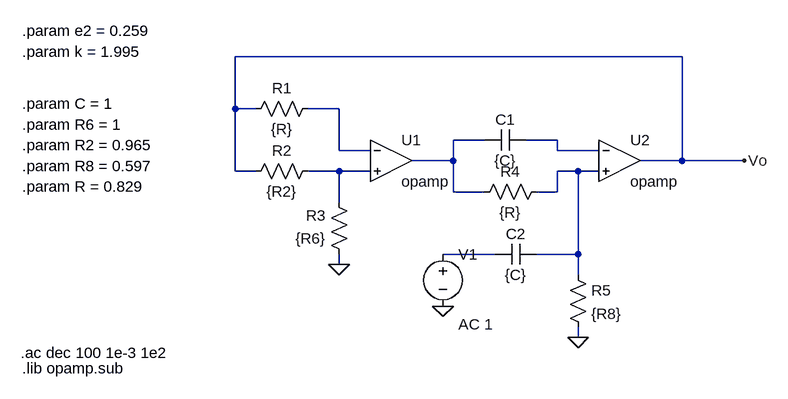
[diagram p0: schematic Draft1.asc]
Draft1.asc, the LTspice schematic file:
Version 4
SHEET 1 880 680
WIRE 576 0 -112 0
WIRE -112 80 -112 0
WIRE -80 80 -112 80
WIRE 48 80 0 80
WIRE 272 128 224 128
WIRE 384 128 336 128
WIRE 48 144 48 80
WIRE 96 144 48 144
WIRE 384 144 384 128
WIRE 448 144 384 144
WIRE 224 160 224 128
WIRE 224 160 160 160
WIRE 576 160 576 0
WIRE 576 160 512 160
WIRE 672 160 576 160
WIRE -112 176 -112 80
WIRE -80 176 -112 176
WIRE 48 176 0 176
WIRE 96 176 48 176
WIRE 416 176 384 176
WIRE 448 176 416 176
WIRE 224 208 224 160
WIRE 272 208 224 208
WIRE 384 208 384 176
WIRE 384 208 352 208
WIRE 48 224 48 176
WIRE 288 304 208 304
WIRE 416 304 416 176
WIRE 416 304 352 304
WIRE 48 320 48 304
WIRE 416 336 416 304
WIRE 416 432 416 416
FLAG 48 320 0
FLAG 416 432 0
FLAG 208 384 0
FLAG 672 160 Vo
SYMBOL OpAmps\\opamp 128 96 R0
SYMATTR InstName U1
SYMBOL OpAmps\\opamp 480 96 R0
SYMATTR InstName U2
SYMBOL res 16 64 R90
WINDOW 0 0 56 VBottom 2
WINDOW 3 32 56 VTop 2
SYMATTR InstName R1
SYMATTR Value {R}
SYMBOL res 16 160 R90
WINDOW 0 0 56 VBottom 2
WINDOW 3 32 56 VTop 2
SYMATTR InstName R2
SYMATTR Value {R2}
SYMBOL res 64 320 R180
WINDOW 0 36 76 Left 2
WINDOW 3 36 40 Left 2
SYMATTR InstName R3
SYMATTR Value {R6}
SYMBOL res 256 224 R270
WINDOW 0 32 56 VTop 2
WINDOW 3 0 56 VBottom 2
SYMATTR InstName R4
SYMATTR Value {R}
SYMBOL res 400 320 R0
SYMATTR InstName R5
SYMATTR Value {R8}
SYMBOL cap 336 112 R90
WINDOW 0 0 32 VBottom 2
WINDOW 3 32 32 VTop 2
SYMATTR InstName C1
SYMATTR Value {C}
SYMBOL cap 352 288 R90
WINDOW 0 0 32 VBottom 2
WINDOW 3 32 32 VTop 2
SYMATTR InstName C2
SYMATTR Value {C}
SYMBOL voltage 208 288 R0
WINDOW 123 24 124 Left 2
WINDOW 39 0 0 Left 0
SYMATTR InstName V1
SYMATTR Value ""
SYMATTR Value2 AC 1
TEXT -440 -40 Left 2 !.param e2 = 0.259
TEXT -440 -8 Left 2 !.param k = 1.995
TEXT -440 72 Left 2 !.param C = 1
TEXT -440 104 Left 2 !.param R6 = 1
TEXT -440 136 Left 2 !.param R2 = 0.965
TEXT -440 168 Left 2 !.param R8 = 0.597
TEXT -440 200 Left 2 !.param R = 0.829
TEXT -442 456 Left 2 !.ac dec 100 1e-3 1e2
TEXT -440 480 Left 2 !.lib opamp.sub

The netlist it stands for:
* Draft1.asc
XU1 N001 N004 N002 opamp Aol=100K GBW=10Meg  ; pins invin noninvin out
XU2 N003 N005 Vo opamp Aol=100K GBW=10Meg  ; pins invin noninvin out
R1 N001 Vo {R}
R2 N004 Vo {R2}
R3 0 N004 {R6}
R4 N002 N005 {R}
R5 N005 0 {R8}
C1 N003 N002 {C}
C2 N005 N006 {C}
V1 N006 0 AC 1
.param e2 = 0.259
.param k = 1.995
.param C = 1
.param R6 = 1
.param R2 = 0.965
.param R8 = 0.597
.param R = 0.829
.ac dec 100 1e-3 1e2
.lib opamp.sub
.backanno
.end